# EAGLE board borrador_1 (EAGLE 9.5.2)
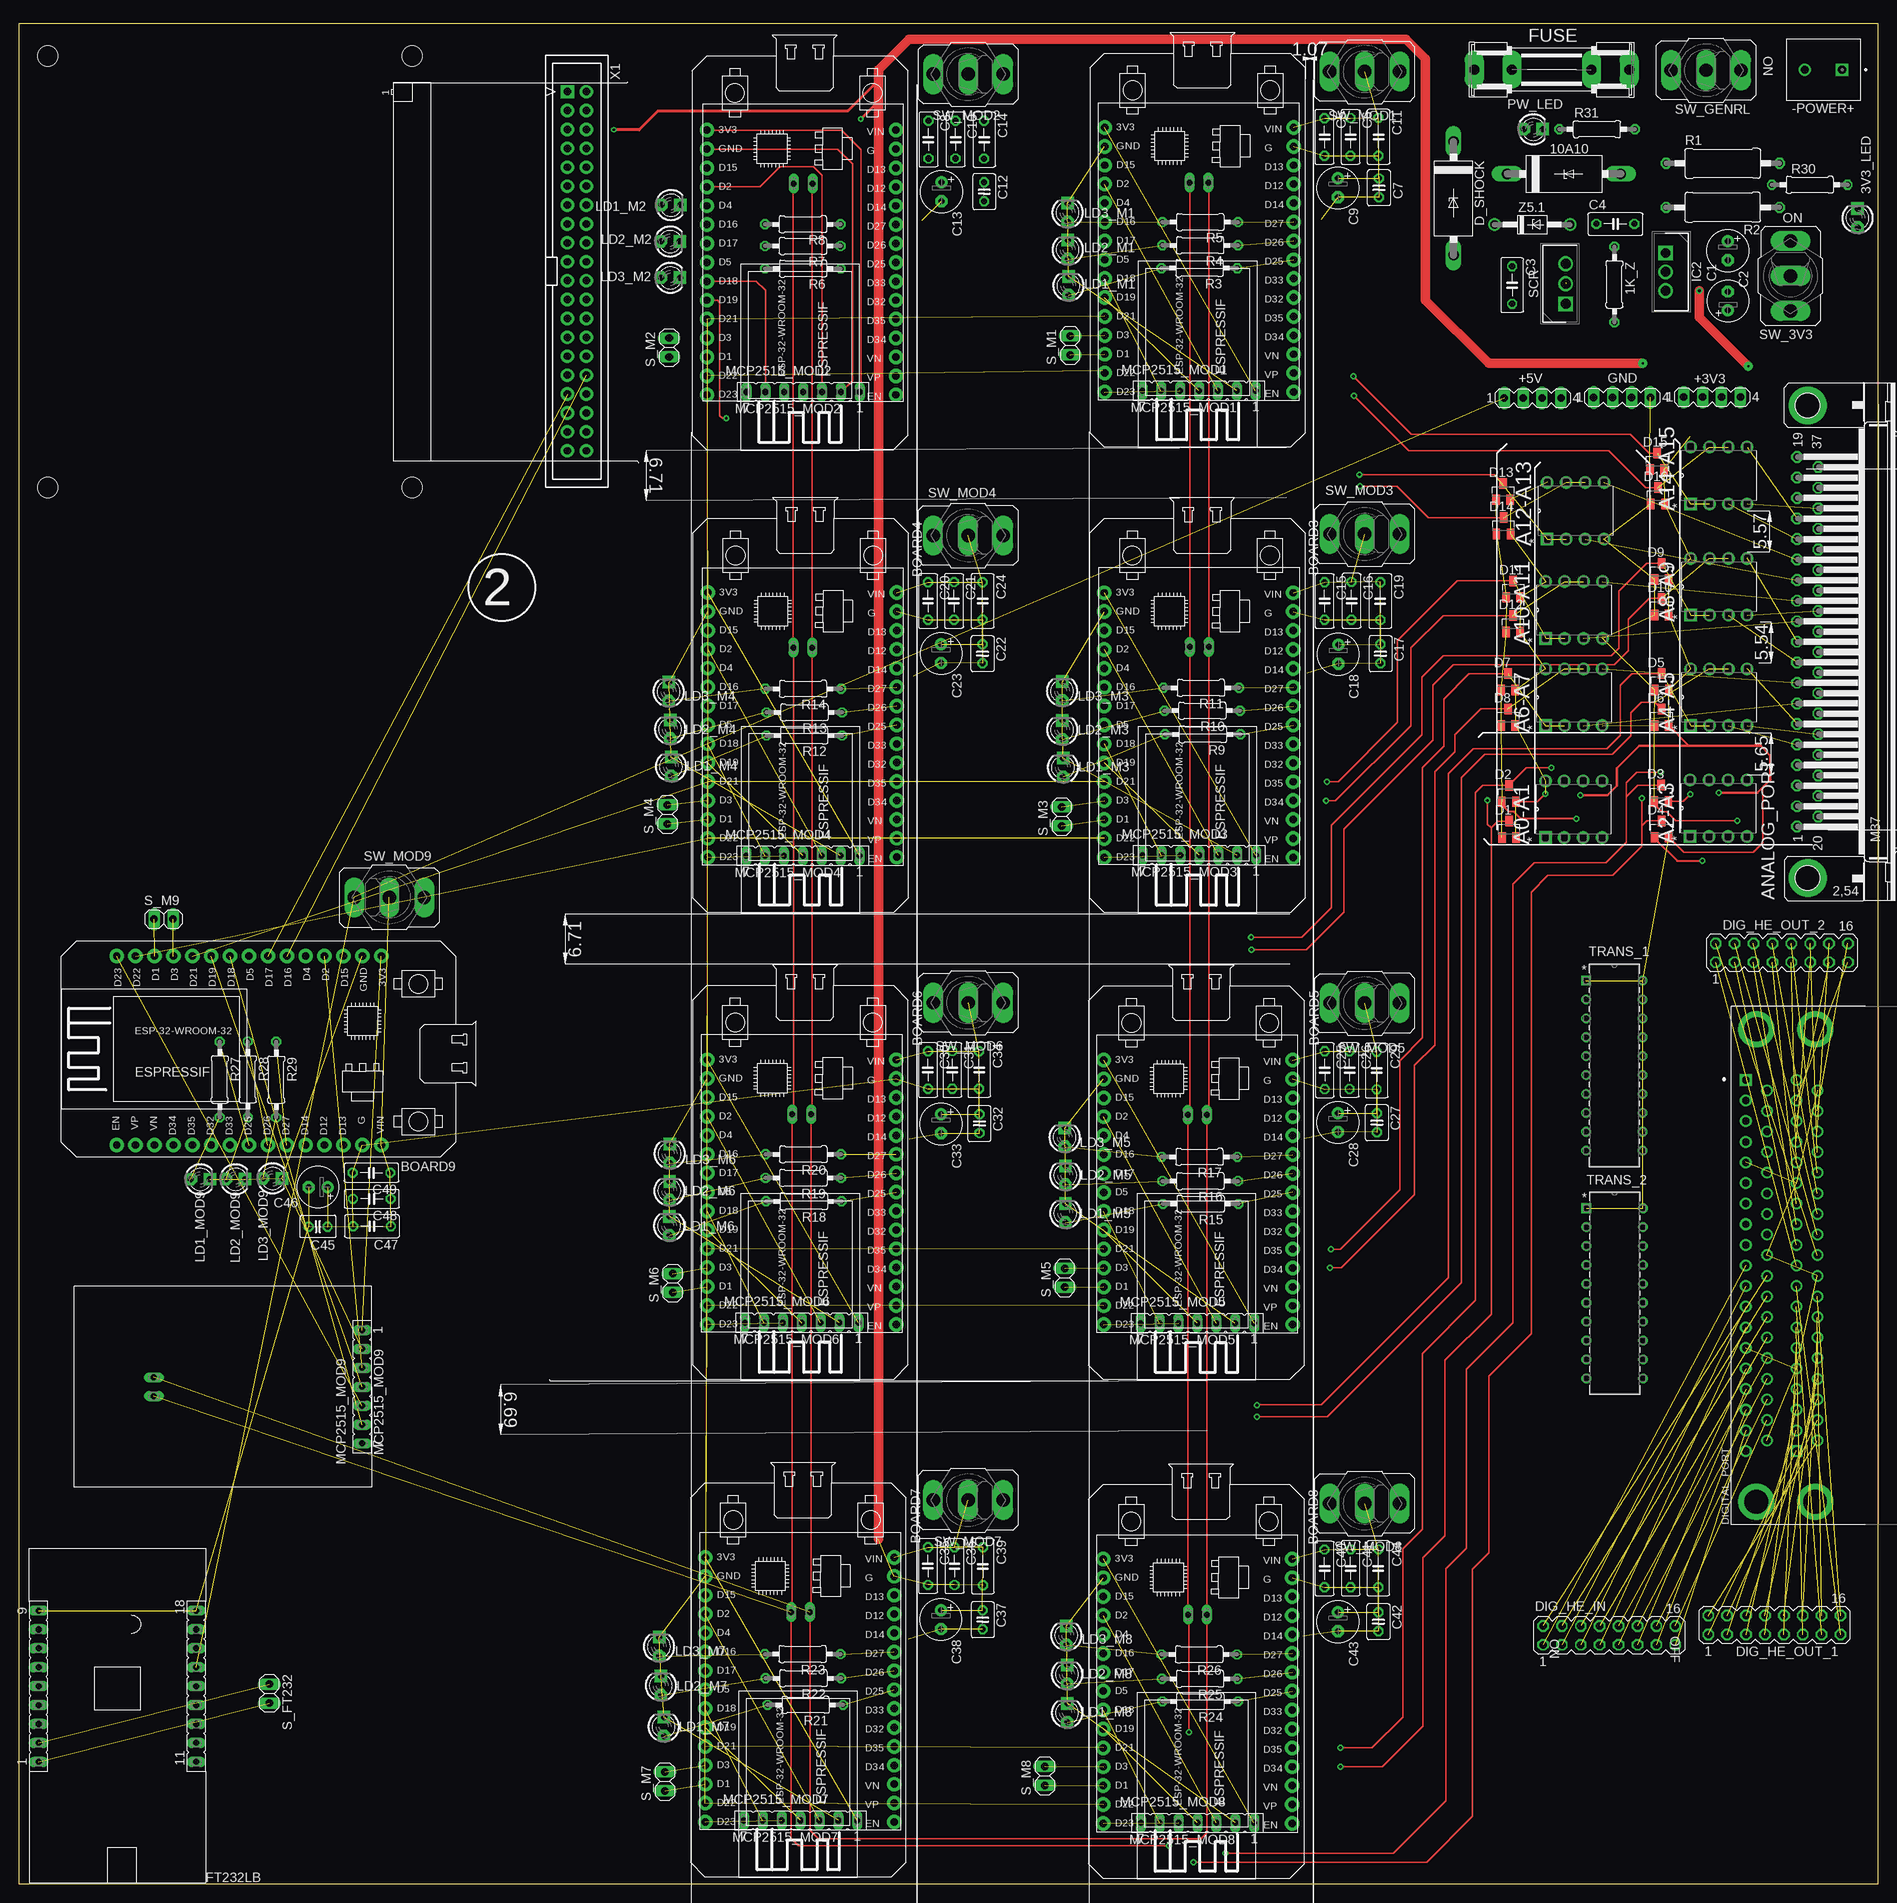
[diagram p9: board, top side]
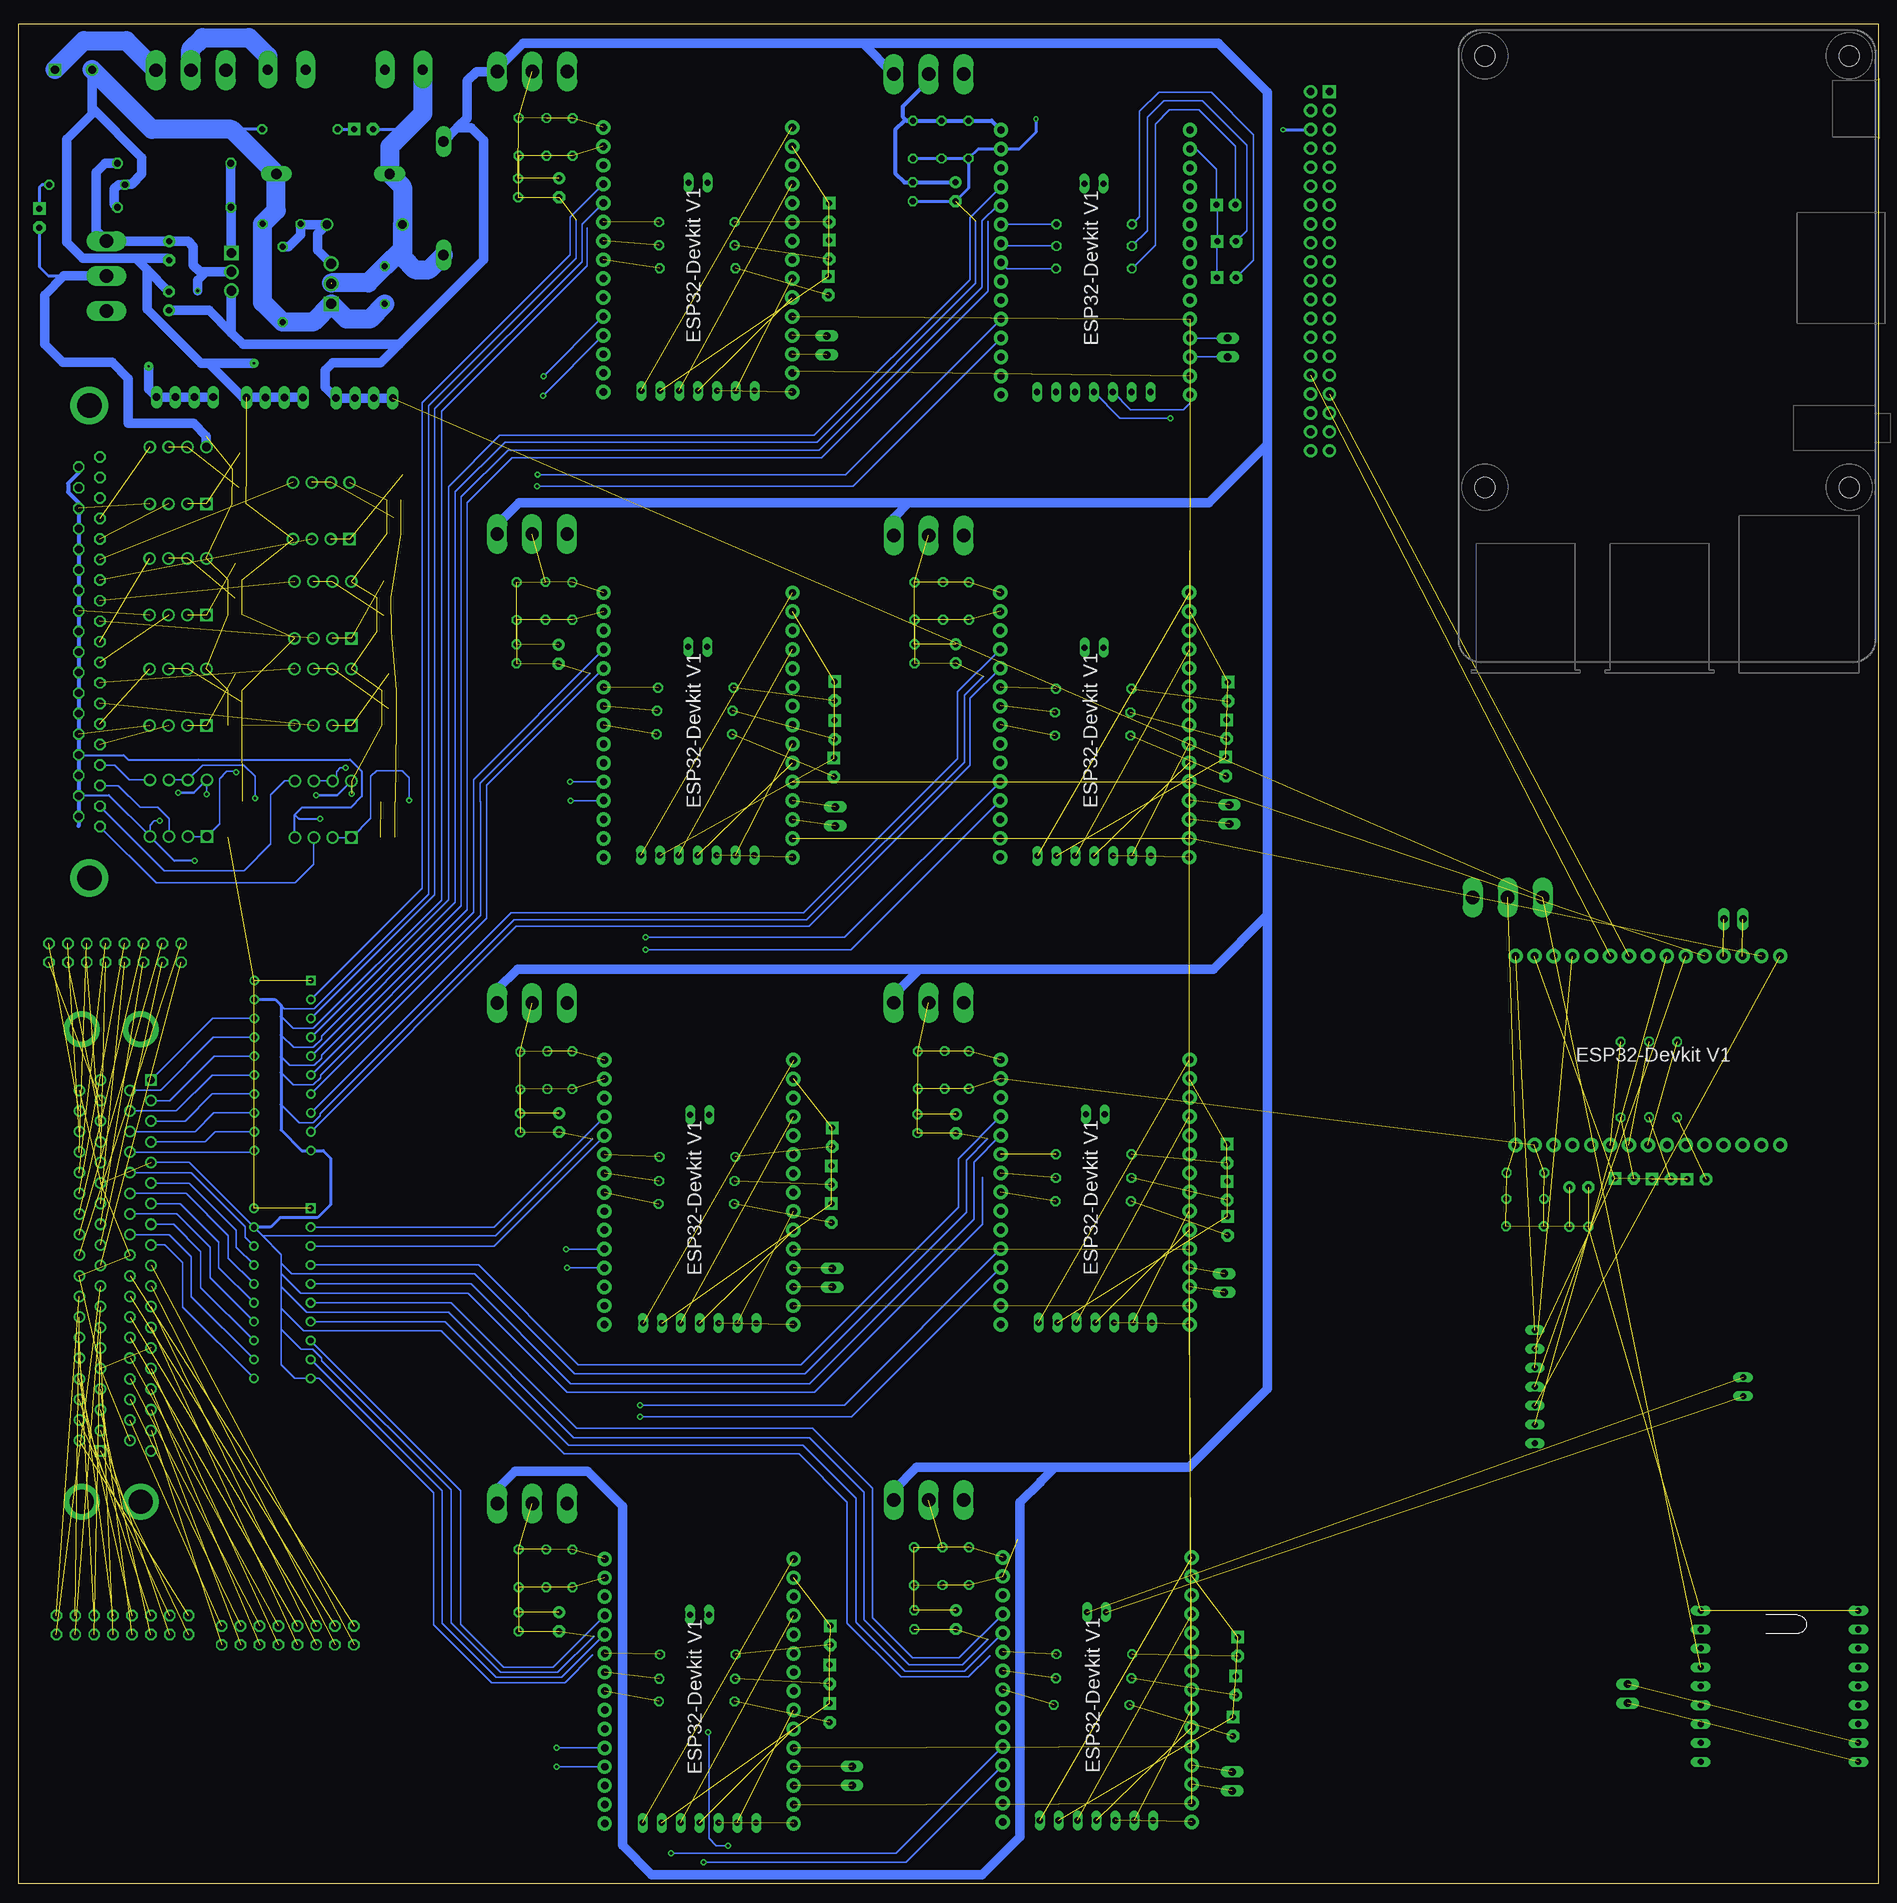
[diagram p10: board, bottom side, seen from below]

Size 250 x 250 mm. Coordinates in mm from the lower left corner, seen from the top.
Outline: 0,0 250,0 250,250 0,250 0,0
Copper layers (1*16): Top 0.035mm / dielectric 12mil / Bottom 0.035mm
Design rules "default *": minimum track width 0.2mm, minimum drill 0.3mm, track to track 0.4mm, track to pad 0.4mm, pad to pad 0.4mm, via to via 0.4mm, smd to smd 6mil, copper to edge 0.4mm, drill to drill 0.4mm, minimum pad ring 10mil, minimum via ring 8mil, stop-mask expansion 4mil, vias tented up to drill 0mil, thermal gap 10mil

## Footprints (pad centres in the part's own frame; a part is rotated, then mirrored left to right if it is on the bottom)
0207/10 = drill 0.813 octagon: 1 -5.08,0; 2 5.08,0
LED3MM = drill 0.813 pad 1.676 octagon: A -1.27,0 | drill 0.813 pad 1.676 square: K 1.27,0
CB429-15 = drill 1.397 long: A 7.62,0; C -7.62,0
MA04-1 = drill 1.016 long: 1 -3.81,0; 2 -1.27,0; 3 1.27,0; 4 3.81,0
CONN_282836-2 = drill 1.1 square: 1 -2.5,0 | drill 1.1: 2 2.5,0
DIP254P762X508-8 = drill 1.118 square: 1 -7.62,7.62 | drill 1.118: 2 -7.62,5.08; 3 -7.62,2.54; 4 -7.62,0; 5 0,0; 6 0,2.54; 7 0,5.08; 8 0,7.62
M37HP = drill 1.016 octagon: 1 -24.841,1.42; 2 -22.098,1.42; 3 -19.329,1.42; 4 -16.561,1.42; 5 -13.818,1.42; 6 -11.049,1.42; 7 -8.28,1.42; 8 -5.512,1.42; 9 -2.769,1.42; 10 0,1.42; 11 2.769,1.42; 12 5.512,1.42; 13 8.28,1.42; 14 11.049,1.42; 15 13.792,1.42; 16 16.561,1.42; 17 19.329,1.42; 18 22.073,1.42; 19 24.841,1.42; 20 -23.47,-1.42; 21 -20.701,-1.42; 22 -17.958,-1.42; 23 -15.189,-1.42; 24 -12.421,-1.42; 25 -9.652,-1.42; 26 -6.909,-1.42; 27 -4.14,-1.42; 28 -1.372,-1.42; 29 1.372,-1.42; 30 4.14,-1.42; 31 6.909,-1.42; 32 9.652,-1.42; 33 12.421,-1.42; 34 15.189,-1.42; 35 17.932,-1.42; 36 20.701,-1.42; 37 23.47,-1.42 | drill 3.302 pad 5.08: G1 -31.75,0; G2 31.75,0
ESP32-DEVKITV1 = drill 1 pad 1.93: 3V3 0,0; D1 30.48,0; D2 7.62,0; D3 27.94,0; D4 10.16,0; D5 17.78,0; D12 7.62,25.4; D13 5.08,25.4; D14 10.16,25.4; D15 5.08,0; D16 12.7,0; D17 15.24,0; D18 20.32,0; D19 22.86,0; D21 25.4,0; D22 33.02,0; D23 35.56,0; D25 17.78,25.4; D26 15.24,25.4; D27 12.7,25.4; D32 22.86,25.4; D33 20.32,25.4; D34 27.94,25.4; D35 25.4,25.4; EN 35.56,25.4; GND 2.54,25.4; GND@1 2.54,0; VIN 0,25.4; VN 30.48,25.4; VP 33.02,25.4
E2,5-6 = drill 0.813 pad 1.6: + -1.27,0 | drill 0.813 pad 1.6 octagon: - 1.27,0
C050-030X075 = drill 0.813 octagon: 1 -2.54,0; 2 2.54,0
C050-025X075 = drill 0.813 octagon: 1 -2.54,0; 2 2.54,0
C025-030X050 = drill 0.813 octagon: 1 -1.27,0; 2 1.27,0
SOT23 = smd 1 x 1.4: 1 -0.95,-1.1; 2 0.95,-1.1; 3 0,1.1
MA08-2 = drill 1.016 octagon: 1 -8.89,-1.27; 2 -8.89,1.27; 3 -6.35,-1.27; 4 -6.35,1.27; 5 -3.81,-1.27; 6 -3.81,1.27; 7 -1.27,-1.27; 8 -1.27,1.27; 9 1.27,-1.27; 10 1.27,1.27; 11 3.81,-1.27; 12 3.81,1.27; 13 6.35,-1.27; 14 6.35,1.27; 15 8.89,-1.27; 16 8.89,1.27
ASSMANN_WSW_COMPONENTS_ASUB-277-37TP25_0 = drill 3.2 pad 4.85: 1 -31.75,9.65; 2 31.75,9.65; 3 -31.75,1.75; 4 31.75,1.75 | drill 1 pad 1.55 square: F1 24.93,11.07; M1 -24.93,4.27 | drill 1 pad 1.55: F2 22.16,11.07; F3 19.39,11.07; F4 16.62,11.07; F5 13.85,11.07; F6 11.08,11.07; F7 8.31,11.07; F8 5.54,11.07; F9 2.77,11.07; F10 0,11.07; F11 -2.77,11.07; F12 -5.54,11.07; F13 -8.31,11.07; F14 -11.08,11.07; F15 -13.85,11.07; F16 -16.62,11.07; F17 -19.39,11.07; F18 -22.16,11.07; F19 -24.93,11.07; F20 23.545,8.23; F21 20.775,8.23; F22 18.005,8.23; F23 15.235,8.23; F24 12.465,8.23; F25 9.695,8.23; F26 6.925,8.23; F27 4.155,8.23; F28 1.385,8.23; F29 -1.385,8.23; F30 -4.155,8.23; F31 -6.925,8.23; F32 -9.695,8.23; F33 -12.465,8.23; F34 -15.235,8.23; F35 -18.005,8.23; F36 -20.775,8.23; F37 -23.545,8.23; M2 -22.16,4.27; M3 -19.39,4.27; M4 -16.62,4.27; M5 -13.85,4.27; M6 -11.08,4.27; M7 -8.31,4.27; M8 -5.54,4.27; M9 -2.77,4.27; M10 0,4.27; M11 2.77,4.27; M12 5.54,4.27; M13 8.31,4.27; M14 11.08,4.27; M15 13.85,4.27; M16 16.62,4.27; M17 19.39,4.27; M18 22.16,4.27; M19 24.93,4.27; M20 -23.545,1.43; M21 -20.775,1.43; M22 -18.005,1.43; M23 -15.235,1.43; M24 -12.465,1.43; M25 -9.695,1.43; M26 -6.925,1.43; M27 -4.155,1.43; M28 -1.385,1.43; M29 1.385,1.43; M30 4.155,1.43; M31 6.925,1.43; M32 9.695,1.43; M33 12.465,1.43; M34 15.235,1.43; M35 18.005,1.43; M36 20.775,1.43; M37 23.545,1.43
FT232BL = drill 0.813 long: 1 1.27,1.27; 2 1.27,3.81; 3 1.27,6.35; 4 1.27,8.89; 5 1.27,11.43; 6 1.27,13.97; 7 1.27,16.51; 8 1.27,19.05; 9 1.27,21.59; 10 22.47,1.27; 11 22.47,3.81; 12 22.47,6.35; 13 22.47,8.89; 14 22.47,11.43; 15 22.47,13.97; 16 22.47,16.51; 17 22.47,19.05; 18 22.47,21.59
SHK20L = drill 1.321 pad 2.54 long: 1A -10.414,0; 1B -5.334,0; 2A 10.414,0; 2B 5.334,0
TO255P460X1020X2008-3P = drill 1.32 pad 1.98 square: 1 0,0 | drill 1.32 pad 1.98: 2 2.55,0; 3 5.1,0
MCP2515 = drill 0.813 long: 1 1.27,-6.35; 2 1.27,-3.81; 3 1.27,-1.27; 4 1.27,1.27; 5 1.27,3.81; 6 1.27,6.35; 7 1.27,8.89; 8 29.27,0; 9 29.27,2.54
0411/15 = drill 0.914 octagon: 1 -7.62,0; 2 7.62,0
1X02 = drill 1.016 long: 1 -1.27,0; 2 1.27,0
TO270P460X1020X2008-3P = drill 1.32 pad 1.98 square: 1 0,0 | drill 1.32 pad 1.98: 2 2.7,0; 3 5.4,0
M9040P = drill 1.803 long: 1 0,4.699; 2 0,0; 3 0,-4.699
N20 = drill 0.787 pad 1.295 square: 1 0,0 | drill 0.787 pad 1.295: 2 0,-2.54; 3 0,-5.08; 4 0,-7.62; 5 0,-10.16; 6 0,-12.7; 7 0,-15.24; 8 0,-17.78; 9 0,-20.32; 10 0,-22.86; 11 7.62,-22.86; 12 7.62,-20.32; 13 7.62,-17.78; 14 7.62,-15.24; 15 7.62,-12.7; 16 7.62,-10.16; 17 7.62,-7.62; 18 7.62,-5.08; 19 7.62,-2.54; 20 7.62,0
RASPI_GPIO_B+_BOX = drill 1 pad 1.778 square: 1 -24.13,-1.27 | drill 1 pad 1.778: 2 -24.13,1.27; 3 -21.59,-1.27; 4 -21.59,1.27; 5 -19.05,-1.27; 6 -19.05,1.27; 7 -16.51,-1.27; 8 -16.51,1.27; 9 -13.97,-1.27; 10 -13.97,1.27; 11 -11.43,-1.27; 12 -11.43,1.27; 13 -8.89,-1.27; 14 -8.89,1.27; 15 -6.35,-1.27; 16 -6.35,1.27; 17 -3.81,-1.27; 18 -3.81,1.27; 19 -1.27,-1.27; 20 -1.27,1.27; 21 1.27,-1.27; 22 1.27,1.27; 23 3.81,-1.27; 24 3.81,1.27; 25 6.35,-1.27; 26 6.35,1.27; 27 8.89,-1.27; 28 8.89,1.27; 29 11.43,-1.27; 30 11.43,1.27; 31 13.97,-1.27; 32 13.97,1.27; 33 16.51,-1.27; 34 16.51,1.27; 35 19.05,-1.27; 36 19.05,1.27; 37 21.59,-1.27; 38 21.59,1.27; 39 24.13,-1.27; 40 24.13,1.27
RASPI_BOARD_B+_FULL = hole 2.75: 3.5,3.5; 3.5,52.5; 61.5,3.5; 61.5,52.5
DO41Z10 = drill 1.118: A 5.08,0; C -5.08,0

## Placement (x,y rotation side)
1K_Z  [0207/10]  214.52,214.94 270 top
3V3_LED  [LED3MM]  247.22,223.85 90 top
10A10  [CB429-15]  207.74,229.78 0 top
+3V3  [MA04-1]  227.65,199.78 0 top
+5V  [MA04-1]  203.52,199.65 0 top
-POWER+  282836-2  [CONN_282836-2]  242.62,243.8 180 top
A0-A1  OPA2350PA  [DIP254P762X508-8]  212.86,148.22 90 top
A2-A3  OPA2350PA  [DIP254P762X508-8]  232.32,148.36 90 top
A4-A5  OPA2350PA  [DIP254P762X508-8]  232.38,163.27 90 top
A6-A7  OPA2350PA  [DIP254P762X508-8]  212.89,163.26 90 top
A8-A9  OPA2350PA  [DIP254P762X508-8]  232.38,178.12 90 top
A10-A11  OPA2350PA  [DIP254P762X508-8]  212.91,175 90 top
A12-A13  OPA2350PA  [DIP254P762X508-8]  213.12,188.32 90 top
A14-A15  OPA2350PA  [DIP254P762X508-8]  232.37,193.07 90 top
ANALOG_PORT  [M37HP]  240.5,166.91 90 top
BOARD1  ESP32DEVKITV1  [ESP32-DEVKITV1]  146,236.03 270 top
BOARD2  ESP32DEVKITV1  [ESP32-DEVKITV1]  92.54,235.67 270 top
BOARD3  ESP32DEVKITV1  [ESP32-DEVKITV1]  145.96,173.5 270 top
BOARD4  ESP32DEVKITV1  [ESP32-DEVKITV1]  92.63,173.52 270 top
BOARD5  ESP32DEVKITV1  [ESP32-DEVKITV1]  145.85,110.7 270 top
BOARD6  ESP32DEVKITV1  [ESP32-DEVKITV1]  92.58,110.74 270 top
BOARD7  ESP32DEVKITV1  [ESP32-DEVKITV1]  92.3,43.86 270 top
BOARD8  ESP32DEVKITV1  [ESP32-DEVKITV1]  145.82,43.66 270 top
BOARD9  ESP32DEVKITV1  [ESP32-DEVKITV1]  48.75,124.68 180 top
C1  [E2,5-6]  229.79,212.71 90 top
C2  [E2,5-6]  229.77,219.47 270 top
C3  [C050-030X075]  200.77,214.85 270 top
C4  [C050-030X075]  214.65,223.06 0 top
C5  0.1uF  [C050-025X075]  175.54,234.75 270 top
C6  0.1uF  [C050-025X075]  179.05,234.76 270 top
C7  10uF  [C025-030X050]  182.86,227.91 270 top
C8  0.1uF  [C050-025X075]  122.3,234.4 270 top
C9  100uF  [E2,5-6]  177.35,227.91 270 top
C10  0.1uF  [C050-025X075]  125.95,234.4 270 top
C11  1uF  [C050-030X075]  182.8,234.77 270 top
C12  10uF  [C025-030X050]  129.8,227.39 270 top
C13  100uF  [E2,5-6]  124.06,227.39 270 top
C14  1uF  [C050-030X075]  129.79,234.39 270 top
C15  0.1uF  [C050-025X075]  175.56,172.39 270 top
C16  0.1uF  [C050-025X075]  179.18,172.41 270 top
C17  10uF  [C025-030X050]  183.08,165.31 270 top
C18  100uF  [E2,5-6]  177.39,165.24 270 top
C19  1uF  [C050-030X075]  183.05,172.38 270 top
C20  0.1uF  [C050-025X075]  122.25,172.39 270 top
C21  0.1uF  [C050-025X075]  125.74,172.4 270 top
C22  10uF  [C025-030X050]  129.58,165.31 270 top
C23  100uF  [E2,5-6]  124.02,165.33 270 top
C24  1uF  [C050-030X075]  129.58,172.39 270 top
C25  0.1uF  [C050-025X075]  175.57,109.34 270 top
C26  0.1uF  [C050-025X075]  178.92,109.35 270 top
C27  10uF  [C025-030X050]  182.58,102.28 270 top
C28  100uF  [E2,5-6]  177.35,102.3 270 top
C29  1uF  [C050-030X075]  182.56,109.29 270 top
C30  0.1uF  [C050-025X075]  122.24,109.36 270 top
C31  0.1uF  [C050-025X075]  125.51,109.37 270 top
C32  10uF  [C025-030X050]  129.15,102.16 270 top
C33  100uF  [E2,5-6]  124,102.12 270 top
C34  1uF  [C050-030X075]  129.12,109.36 270 top
C35  0.1uF  [C050-025X075]  122.24,42.7 270 top
C36  0.1uF  [C050-025X075]  125.81,42.69 270 top
C37  10uF  [C025-030X050]  129.6,35.48 270 top
C38  100uF  [E2,5-6]  123.97,35.5 270 top
C39  1uF  [C050-030X075]  129.62,42.66 270 top
C40  0.1uF  [C050-025X075]  175.55,42.37 270 top
C41  0.1uF  [C050-025X075]  179.06,42.39 270 top
C42  10uF  [C025-030X050]  182.8,35.22 270 top
C43  100uF  [E2,5-6]  177.36,35.21 270 top
C44  1uF  [C050-030X075]  182.78,42.39 270 top
C45  10uF  [C025-030X050]  40.25,88.31 180 top
C46  100uF  [E2,5-6]  40.25,93.63 180 top
C47  1uF  [C050-030X075]  47.51,88.36 180 top
C48  0.1uF  [C050-025X075]  47.48,92.03 180 top
C49  0.1uF  [C050-025X075]  47.43,95.54 180 top
D1  BAT54S  [SOT23]  200.35,141.72 0 top
D2  BAT54S  [SOT23]  200.34,146.51 0 top
D3  BAT54S  [SOT23]  220.82,146.56 0 top
D4  BAT54S  [SOT23]  220.86,141.74 0 top
D5  BAT54S  [SOT23]  220.88,161.52 0 top
D6  BAT54S  [SOT23]  220.86,156.76 0 top
D7  BAT54S  [SOT23]  200.23,161.52 0 top
D8  BAT54S  [SOT23]  200.23,156.78 0 top
D9  BAT54S  [SOT23]  220.87,176.36 0 top
D10  BAT54S  [SOT23]  220.87,171.63 0 top
D11  BAT54S  [SOT23]  200.92,173.99 0 top
D12  BAT54S  [SOT23]  200.89,169.34 0 top
D13  BAT54S  [SOT23]  199.56,187.1 0 top
D14  BAT54S  [SOT23]  199.6,182.51 0 top
D15  BAT54S  [SOT23]  220.26,191.17 0 top
D16  BAT54S  [SOT23]  220.36,186.54 0 top
D_SHOCK  [CB429-15]  192.88,226.5 270 top
DIG_HE_IN  [MA08-2]  213.81,33.38 0 top
DIG_HE_OUT_1  [MA08-2]  236.03,34.76 0 top
DIG_HE_OUT_2  [MA08-2]  237.03,125.11 0 top
DIGITAL_PORT  ASSMANN_WSW_COMPONENTS_ASUB-277-37TP25ASSMANN_WSW_COMPONENTS_ASUB-277-37TP25_0_0  [ASSMANN_WSW_COMPONENTS_ASUB-277-37TP25_0]  243.25,83.09 90 top
FT232LB  [FT232BL]  1.41,15.12 0 top
FUSE  FUSESHK20L  [SHK20L]  206.09,243.8 180 top
GND  [MA04-1]  215.56,199.74 0 top
IC2  LM317T  [TO255P460X1020X2008-3P]  221.39,219.17 270 top
LD1_M1  [LED3MM]  141.15,214.76 90 top
LD1_M2  [LED3MM]  87.7,225.62 0 top
LD1_M3  [LED3MM]  140.41,150.02 90 top
LD1_M4  [LED3MM]  87.72,150.14 90 top
LD1_M5  [LED3MM]  140.73,90.12 90 top
LD1_M6  [LED3MM]  87.48,88.41 90 top
LD1_M7  [LED3MM]  86.74,21.12 90 top
LD1_M8  [LED3MM]  140.97,22.97 90 top
LD1_MOD9  [LED3MM]  24.43,94.68 0 top
LD2_M1  [LED3MM]  141.05,219.61 90 top
LD2_M2  [LED3MM]  87.6,220.72 0 top
LD2_M3  [LED3MM]  140.31,155.08 90 top
LD2_M4  [LED3MM]  87.6,155.15 90 top
LD2_M5  [LED3MM]  140.73,95.22 90 top
LD2_M6  [LED3MM]  87.51,93.13 90 top
LD2_M7  [LED3MM]  86.36,26.62 90 top
LD2_M8  [LED3MM]  140.96,28.14 90 top
LD2_MOD9  [LED3MM]  29.16,94.69 0 top
LD3_M1  [LED3MM]  141.03,224.6 90 top
LD3_M2  [LED3MM]  87.62,215.84 0 top
LD3_M3  [LED3MM]  140.3,160.28 90 top
LD3_M4  [LED3MM]  87.41,160.21 90 top
LD3_M5  [LED3MM]  140.64,100.32 90 top
LD3_M6  [LED3MM]  87.54,98.12 90 top
LD3_M7  [LED3MM]  86.11,31.87 90 top
LD3_M8  [LED3MM]  140.86,33.38 90 top
LD3_MOD9  [LED3MM]  34.14,94.81 0 top
MCP2515_MOD1  [MCP2515]  159.94,199.36 90 top
MCP2515_MOD2  [MCP2515]  106.73,199.21 90 top
MCP2515_MOD3  [MCP2515]  159.99,136.95 90 top
MCP2515_MOD4  [MCP2515]  106.69,136.86 90 top
MCP2515_MOD5  [MCP2515]  159.72,74.08 90 top
MCP2515_MOD6  [MCP2515]  106.54,74.14 90 top
MCP2515_MOD7  [MCP2515]  106.38,7.23 90 top
MCP2515_MOD8  [MCP2515]  159.74,6.9 90 top
MCP2515_MOD9  [MCP2515]  47.45,68.06 180 top
PW_LED  [LED3MM]  203.62,235.8 0 top
R1  [0411/15]  229.09,231.22 0 top
R2  [0411/15]  229.08,225.29 180 top
R3  [0207/10]  158.73,217.13 180 top
R4  [0207/10]  158.82,220.19 180 top
R5  [0207/10]  158.84,223.32 180 top
R6  [0207/10]  105.44,217.07 180 top
R7  [0207/10]  105.42,220.1 180 top
R8  [0207/10]  105.42,223.02 180 top
R9  [0207/10]  159.17,154.47 180 top
R10  [0207/10]  159.11,157.65 180 top
R11  [0207/10]  158.95,160.71 180 top
R12  [0207/10]  105.6,154.31 180 top
R13  [0207/10]  105.61,157.41 180 top
R14  [0207/10]  105.46,160.58 180 top
R15  [0207/10]  158.89,91.36 180 top
R16  [0207/10]  158.84,94.44 180 top
R17  [0207/10]  158.74,97.68 180 top
R18  [0207/10]  105.54,91.7 180 top
R19  [0207/10]  105.47,94.85 180 top
R20  [0207/10]  105.49,98.03 180 top
R21  [0207/10]  105.77,24.03 180 top
R22  [0207/10]  105.49,27.61 180 top
R23  [0207/10]  105.39,30.87 180 top
R24  [0207/10]  158.85,24.5 180 top
R25  [0207/10]  158.79,27.53 180 top
R26  [0207/10]  158.69,30.81 180 top
R27  [0207/10]  27.05,108.09 270 top
R28  [0207/10]  30.82,108.11 270 top
R29  [0207/10]  34.64,108.06 270 top
R30  [0207/10]  240.78,228.33 180 top
R31  [0207/10]  212.17,235.79 0 top
S_FT232  [1X02]  33.7,25.56 270 top
S_M1  [1X02]  141.36,206.75 90 top
S_M2  [1X02]  87.44,206.46 90 top
S_M3  [1X02]  140.22,143.44 90 top
S_M4  [1X02]  87.23,143.72 90 top
S_M5  [1X02]  140.63,81.44 90 top
S_M6  [1X02]  87.92,80.74 90 top
S_M7  [1X02]  86.88,13.75 90 top
S_M8  [1X02]  137.96,14.5 90 top
S_M9  [1X02]  19.48,129.63 0 top
SCR  TYN608RG  [TO270P460X1020X2008-3P]  207.97,212.32 90 top
SW_3V3  [M9040P]  238.19,216.07 180 top
SW_GENRL  [M9040P]  226.84,243.72 90 top
SW_MOD1  [M9040P]  180.95,243.53 90 top
SW_MOD2  [M9040P]  127.66,243.19 90 top
SW_MOD3  [M9040P]  180.97,181.39 90 top
SW_MOD4  [M9040P]  127.65,181.21 90 top
SW_MOD5  [M9040P]  180.97,118.34 90 top
SW_MOD6  [M9040P]  127.66,118.4 90 top
SW_MOD7  [M9040P]  127.65,51.55 90 top
SW_MOD8  [M9040P]  180.96,51.1 90 top
SW_MOD9  [M9040P]  49.82,132.56 270 top
TRANS_1  SN74LVC245AN  [N20]  210.7,121.38 0 top
TRANS_2  SN74LVC245AN  [N20]  210.74,90.78 0 top
X1  RASPI_GPIO_B+_BOX  [RASPI_GPIO_B+_BOX]  75.05,216.71 270 top
X2  RASPI_BOARD_B+#_F  [RASPI_BOARD_B+_FULL]  0.41,249.15 270 top
Z5.1  [DO41Z10]  203.48,222.97 0 top

## Tracks (layer width: path | path; a pad name or v marks a point on that pad's centre or on a via)
3V  (via drill 0.3 pad 1.2, 0.4)
  Top 1.27: v225.93,214.09 225.93,210.51 v232.5,203.94
  Bottom 1.27: R1.2 238.37,231.22 239.58,230.01 239.58,222.16 SW_3V3.3 238.16,220.74 C2.+ 227.23,220.74 226.5,220.01 226.5,217.54 225.58,216.62 224.78,216.62 | +3V3.1 +3V3.2 +3V3.3 +3V3.4 232.5,200.83 v232.5,203.94 | IC2.2 224.78,216.62 | 224.78,216.62 225.93,215.47 v225.93,214.09
5V  (2 unrouted)
  Bottom 0.406: 129.58,247.33 129.57,247.32
  Bottom 1.27: 136.49,247.32 SW_MOD2.3 | 136.49,247.32 182.18,247.32 185.65,243.85 SW_MOD1.3 188.46,243.53 189.7,242.29 189.7,237.3 191.03,235.97 | 136.49,247.32 129.57,247.32 | 129.58,247.33 88.71,247.33 82.12,240.74 82.12,193.44 | SW_MOD4.3 132.35,183.59 130.34,185.6 | 131.04,185.62 131.06,185.6 | 131.06,185.6 182.7,185.6 185.67,182.63 SW_MOD3.3 | 130.34,185.6 89.96,185.6 82.12,193.44 | 130.34,185.6 131.06,185.6 | 82.12,193.44 82.12,130.25 82.1,130.23 | SW_MOD5.3 185.67,120.21 182.95,122.93 128.86,122.93 | 82.1,130.23 89.4,122.93 128.86,122.93 | 128.86,122.93 132.36,119.43 SW_MOD6.3 | 82.1,130.23 82.1,66.52 92.65,55.97 110.7,55.97 | SW_MOD7.3 132.35,52.91 129.29,55.97 110.7,55.97 | 110.7,55.97 112.64,54.03 112.64,53.99 115.38,51.25 115.38,6.34 120.48,1.24 164.89,1.24 168.83,5.18 168.83,50.7 173.54,55.41 183.26,55.41 185.66,53.01 SW_MOD8.3 | D_SHOCK.C 191.03,235.97 | 221.39,208.47 IC2.3 | 198.85,206.89 219.81,206.89 221.39,208.47 | C1.+ 224.36,211.44 221.39,208.47 | 191.03,235.97 189.18,235.97 187.52,234.31 187.52,218.22 198.85,206.89 | 198.85,206.89 201.36,204.38 207.8,204.38 208.8,203.38 208.8,201.12 +5V.4 +5V.3 +5V.2 +5V.1
5V_MOD1  (6 unrouted)
5V_MOD2
  Bottom 0.508: SW_MOD2.2 127.66,242.34 131.16,238.84 131.16,237.48 130.61,236.93 C14.1 | C14.1 C10.1 C8.1 119.21,236.94 BOARD2.VIN | C14.1 130.93,236.93 132.16,235.7 132.16,229.9 130.92,228.66 C12.1 C13.+
5V_MOD3  (6 unrouted)
5V_MOD4  (6 unrouted)
5V_MOD5  (6 unrouted)
5V_MOD6  (6 unrouted)
5V_MOD7  (6 unrouted)
5V_MOD8  (6 unrouted)
5V_MOD9  (6 unrouted)
CAN_H  (via drill 0.4)  (1 unrouted)
  Top 0.2: MCP2515_MOD2.9 104.14,228.43 MCP2515_MOD4.9 104.15,103.56 MCP2515_MOD6.9 104,36.66 MCP2515_MOD7.9 103.84,6.14 104.86,5.12 v154.65,5.12 | v157.33,20.39 157.33,36.04 MCP2515_MOD8.9 157.18,36.19 MCP2515_MOD5.9 157.45,103.62 MCP2515_MOD3.9 157.45,228.58 MCP2515_MOD1.9
  Bottom 0.2: v154.65,5.12 156.22,5.12 157.19,6.09 157.19,20.25 v157.33,20.39
CAN_L  (1 unrouted)
  Top 0.2: MCP2515_MOD2.8 106.68,228.43 MCP2515_MOD4.8 106.69,103.56 MCP2515_MOD6.8 106.54,36.66 MCP2515_MOD7.8 106.38,7.18 107.5,6.06 158.97,6.06 159.74,6.83 MCP2515_MOD8.8 159.72,36.19 MCP2515_MOD5.8 159.99,103.62 MCP2515_MOD3.8 159.99,228.58 MCP2515_MOD1.8
GND_MOD1  (4 unrouted)
GND_MOD2
  Top 0.2: MCP2515_MOD2.2 112.08,202.02 112.08,231.13 110.08,233.13 BOARD2.GND@1
  Bottom 0.2: BOARD2.GND@1 91.67,233.13 88.97,230.43 LD1_M2.K 88.87,225.52 LD2_M2.K 88.89,220.7 LD3_M2.K
GND_MOD3  (4 unrouted)
GND_MOD4  (4 unrouted)
GND_MOD5  (4 unrouted)
GND_MOD6  (4 unrouted)
GND_MOD7  (4 unrouted)
GND_MOD8  (4 unrouted)
GND_MOD9  (4 unrouted)
L_3V3  (via drill 0.4)  (23 unrouted)
  Top 0.2: D3.2 223.77,145.46 v224.7,146.39 | D4.2 223.85,138.6 233.2,138.6 234.5,139.9 234.5,147.37 234.6,147.47 | v205.23,146.51 204.13,145.41 D2.2
  Top 0.305: D6.2 224.52,152.95 | 224.52,152.95 234.17,152.95 235.5,151.62 235.5,148.37 234.6,147.47 233.74,146.61 v228.55,146.61 | 224.52,152.95 217.89,152.95 214.84,149.9 214.84,147.58 213.56,146.3 v209.97,146.3
  Bottom 0.2: A2-A3.8 v224.7,146.39 | A0-A1.8 v205.23,146.51
  Bottom 0.305: v228.55,146.61 226.45,146.61 A2-A3.8 | v209.97,146.3 207.16,146.3 A0-A1.8
  Bottom 0.406: 3V3_LED.A 247.22,217.3 245.99,216.07 243.9,216.07
  Bottom 1.27: SW_3V3.2 243.9,216.07 246.49,213.48 246.49,206.88 244.08,204.47 237.44,204.47 235.24,202.27 235.24,196.25 226.48,196.25 224.75,194.52 A14-A15.8
L_AO_0  (via drill 0.4)
  Top 0.2: D1.3 198.86,142.82 197.95,141.91 | 197.95,141.91 197.95,76.54 191.76,70.35 191.76,46.8 188.78,43.82 188.78,21.18 183.32,15.72 v177.66,15.72 | v197.47,145.58 197.47,142.39 197.95,141.91
  Bottom 0.2: v177.66,15.72 BOARD8.D34 | A0-A1.2 A0-A1.1 202.67,143.17 202.67,148.82 201.89,149.6 198.46,149.6 197.47,148.61 v197.47,145.58
L_AO_0_P
  Bottom 0.2: A0-A1.3 210.32,136.99 212.75,134.56 212.8,134.51 212.81,134.5 231.52,134.5 ANALOG_PORT.1
L_AO_1  (via drill 0.4)
  Top 0.2: v177.69,18.26 181.92,18.26 186.06,22.4 186.06,45.01 188.68,47.63 188.68,71.22 195.85,78.39 195.85,146.63 196.83,147.61 D2.3 202.68,149.95 v206.04,149.95
  Bottom 0.2: v177.69,18.26 BOARD8.D35 | A0-A1.6 A0-A1.7 207.27,148.73 207.27,149.45 206.77,149.95 v206.04,149.95
L_AO_1_P
  Bottom 0.2: A0-A1.5 214.23,148.22 216.09,146.36 216.09,139.74 219.67,136.16 230.43,136.16 ANALOG_PORT.2
L_AO_2  (via drill 0.4)
  Top 0.2: D3.3 217.65,147.66 216.1,146.11 | 216.1,146.11 216.1,139.95 213.34,137.19 203.74,137.19 200.87,134.32 200.87,75.41 194.63,69.17 194.63,45.08 191.89,42.34 191.89,11.14 184.83,4.08 v162.26,4.08 | v220.77,149.4 217.51,149.4 216.1,147.99 216.1,146.11
  Bottom 0.2: v162.26,4.08 132.08,4.08 BOARD7.D35 | v220.77,149.4 220.77,149.49 222,149.49 222.97,148.52 222.97,142.47 A2-A3.1 A2-A3.2
L_AO_2_P
  Bottom 0.2: A2-A3.3 229.78,143.14 231.31,144.66 233.68,144.66 236.59,147.58 ANALOG_PORT.3
L_AO_3  (via drill 0.4)
  Top 0.2: D4.3 218.9,142.84 218.23,142.17 | 218.23,142.17 218.23,139.42 214.32,135.51 205.6,135.51 203.36,133.27 203.36,73.92 197.66,68.22 197.66,44.48 195.45,42.27 195.45,9.04 189.31,2.9 v157.94,2.9 | v157.94,2.9 157.91,2.9 | v157.94,2.9 | v218.23,145.86 218.23,142.17
  Bottom 0.2: v157.94,2.9 130.72,2.9 BOARD7.D34 | v218.23,145.86 218.23,148.82 219.73,150.32 225.28,150.32 A2-A3.7 A2-A3.6
L_AO_3_P
  Bottom 0.2: ANALOG_PORT.4 237.11,150.35 235.12,148.36 A2-A3.5
L_AO_4  (via drill 0.4)  (2 unrouted)
  Top 0.2: D5.3 216.85,162.62 215.3,161.07 215.3,154.32 213.52,152.54 195.58,152.54 192.21,149.17 192.21,81.46 175.1,64.35 166.49,64.35 v166.46,64.32
  Bottom 0.2: v166.46,64.32 139,64.32 BOARD6.D35
L_AO_4_P  (1 unrouted)
L_AO_5  (via drill 0.4)  (2 unrouted)
  Top 0.2: D6.3 219.96,158.76 218.11,158.76 216.73,157.38 216.73,154.28 214.24,151.79 197.08,151.79 193.96,148.67 193.96,80.75 175.97,62.76 v166.48,62.76
  Bottom 0.2: v166.48,62.76 138.02,62.76 BOARD6.D34
L_AO_5_P  (1 unrouted)
L_AO_6  (via drill 0.4)  (2 unrouted)
  Top 0.2: D7.3 194.97,162.62 191.57,159.22 191.57,152.84 188.71,149.98 188.71,113.67 185.67,110.63 185.67,93.27 177.7,85.3 v176.42,85.3
  Bottom 0.2: v176.42,85.3 BOARD5.D35
L_AO_6_P  (1 unrouted)
L_AO_7  (via drill 0.4)  (2 unrouted)
  Top 0.2: D8.3 196.54,157.88 193.08,154.42 193.08,152.11 190.41,149.44 190.41,112.72 187.66,109.97 187.66,92.62 177.83,82.79 v176.25,82.79
  Bottom 0.2: v176.25,82.79 171.28,82.79 BOARD5.D34
L_AO_7_P  (1 unrouted)
L_AO_8  (via drill 0.4)  (2 unrouted)
  Top 0.2: D9.3 218.9,177.46 215.12,173.68 215.12,166.05 214.1,165.03 191.52,165.03 188.62,162.13 188.62,154.4 176.5,142.28 176.5,131.19 172.49,127.18 v165.69,127.18
  Bottom 0.2: v165.69,127.18 138.97,127.18 BOARD4.D35
L_AO_8_P  (1 unrouted)
L_AO_9  (via drill 0.4)  (2 unrouted)
  Top 0.2: D10.3 219.2,172.73 216.41,169.94 216.41,165.69 214.52,163.8 192.88,163.8 190.15,161.07 190.15,153.66 178.19,141.7 178.19,130.53 173.15,125.49 v165.73,125.49
  Bottom 0.2: v165.73,125.49 138.12,125.49 BOARD4.D34
L_AO_9_P  (1 unrouted)
L_AO_10  (via drill 0.4)  (2 unrouted)
  Top 0.2: D11.3 193.39,175.09 185.35,167.05 185.35,156.08 177.39,148.12 v175.87,148.12
  Bottom 0.2: v175.87,148.12 171.38,148.12 BOARD3.D35
L_AO_10_P  (1 unrouted)
L_AO_11  (via drill 0.4)  (2 unrouted)
  Top 0.2: D12.3 191.5,170.44 187.15,166.09 187.15,155.64 177.04,145.53 v175.77,145.53
  Bottom 0.2: v175.77,145.53 171.39,145.53 BOARD3.D34
L_AO_11_P  (1 unrouted)
L_AO_12  (via drill 0.4)  (2 unrouted)
  Top 0.2: D13.3 198.37,189.39 v180.24,189.39
  Bottom 0.2: BOARD2.D35 138.82,189.39 v180.24,189.39
L_AO_12_P  (1 unrouted)
L_AO_13  (via drill 0.4)  (2 unrouted)
  Top 0.2: D14.3 189.5,183.61 185.29,187.82 v180.32,187.82
  Bottom 0.2: v180.32,187.82 137.85,187.82 BOARD2.D34
L_AO_13_P  (1 unrouted)
L_AO_14  (via drill 0.4)  (2 unrouted)
  Top 0.2: D15.3 219.19,192.27 216.67,194.79 187.24,194.79 v179.43,202.6
  Bottom 0.2: v179.43,202.6 BOARD1.D35
L_AO_14_P  (1 unrouted)
L_AO_15  (via drill 0.4)  (2 unrouted)
  Top 0.2: D16.3 218.76,187.64 213.8,192.6 213.8,192.61 186.88,192.61 v179.49,200
  Bottom 0.2: v179.49,200 BOARD1.D34
L_AO_15_P  (1 unrouted)
L_DI_0
  Bottom 0.2: TRANS_1.2 195.78,133.76 195.78,199.01 175.85,218.94 175.85,223.96 BOARD1.D12
L_DI_0_P
  Bottom 0.2: DIGITAL_PORT.F1 223.9,116.3 TRANS_1.18
L_DI_1
  Bottom 0.2: TRANS_1.3 194.06,132.94 194.06,198.22 174.28,218 174.28,222.99 BOARD1.D14
L_DI_1_P
  Bottom 0.2: DIGITAL_PORT.F20 234.99,106.67 230.93,106.67 223.83,113.76 TRANS_1.17
L_DI_2
  Bottom 0.2: TRANS_1.4 192.21,132.25 192.21,187.77 185.32,194.66 143.05,194.66 122.12,215.59 122.12,223.87 BOARD2.D12
L_DI_2_P
  Bottom 0.2: DIGITAL_PORT.F2 229.69,105.25 223.72,111.22 TRANS_1.16
L_DI_3
  Bottom 0.2: TRANS_1.5 190.49,131.43 190.49,186.4 184.22,192.67 142.37,192.67 120.47,214.57 120.47,223.48 118.44,225.51 BOARD2.D14
L_DI_3_P
  Bottom 0.2: DIGITAL_PORT.F21 228.81,103.86 223.99,108.68 TRANS_1.15
L_DI_4
  Bottom 0.2: TRANS_1.6 188.84,130.54 188.84,148.4 BOARD3.D12
L_DI_4_P
  Bottom 0.2: DIGITAL_PORT.F3 227.63,102.48 223.97,106.14 TRANS_1.14
L_DI_5
  Bottom 0.2: TRANS_1.7 187.1,129.74 187.1,147.6 BOARD3.D14
L_DI_5_P
  Bottom 0.2: DIGITAL_PORT.F22 226.25,101.09 223.75,103.6 TRANS_1.13
L_DI_6
  Bottom 0.2: TRANS_1.8 183.81,130.49 144.46,130.49 123.76,151.19 123.76,160.17 BOARD4.D12
L_DI_6_P
  Bottom 0.2: DIGITAL_PORT.F4 224.93,99.71 223.58,101.06 TRANS_1.12
L_DI_7
  Bottom 0.2: TRANS_1.9 183.11,128.65 143.73,128.65 122.08,150.3 122.08,159.31 BOARD4.D14
L_DI_7_P
  Bottom 0.2: DIGITAL_PORT.F23 218.51,98.33 TRANS_1.11
L_DI_8
  Bottom 0.2: TRANS_2.2 186.09,88.24 BOARD5.D12
L_DI_8_P
  Bottom 0.2: DIGITAL_PORT.F24 226.76,95.56 219.52,88.31 219.52,86.86 TRANS_2.18
L_DI_9
  Bottom 0.2: TRANS_2.3 186.09,85.7 BOARD5.D14
L_DI_9_P
  Bottom 0.2: DIGITAL_PORT.F6 227.07,94.17 220.74,87.84 220.74,85.54 TRANS_2.17
L_DI_10
  Bottom 0.2: TRANS_2.4 188.19,83.16 174.79,69.76 144.82,69.76 123.65,90.93 123.65,97.45 BOARD6.D12
L_DI_10_P
  Bottom 0.2: DIGITAL_PORT.F25 229.94,92.78 229.93,92.79 227.49,92.79 221.81,87.11 221.81,84.07 TRANS_2.16
L_DI_11
  Bottom 0.2: TRANS_2.5 189.17,80.62 175.77,67.22 143.68,67.22 121.59,89.31 121.59,96.97 BOARD6.D14
L_DI_11_P
  Bottom 0.2: DIGITAL_PORT.F7 228.28,91.4 223.07,86.19 223.07,82.79 TRANS_2.15
L_DI_012
  Bottom 0.2: TRANS_2.6 191.88,78.08 175,61.2 143.27,61.2 135.22,53.15 135.22,35.74 129.85,30.37 123.57,30.37 BOARD7.D12
L_DI_12_P
  Bottom 0.2: DIGITAL_PORT.F26 231.81,90.02 231.8,90.01 228.73,90.01 224.27,85.55 224.27,81.45 TRANS_2.14
L_DI_13
  Bottom 0.2: TRANS_2.7 192.69,75.54 176.07,58.92 144.53,58.92 137.45,51.84 137.45,35.16 130.87,28.58 122.82,28.58 BOARD7.D14
L_DI_13_P
  Bottom 0.2: TRANS_2.13 225.49,80.13 225.49,84.95 229.17,88.63 DIGITAL_PORT.F8
L_DI_014
  Bottom 0.2: TRANS_2.8 190.58,52.84 190.58,34.89 184.81,29.12 178.14,29.12 BOARD8.D12
L_DI_14_P
  Bottom 0.2: DIGITAL_PORT.F27 230.72,87.25 230.71,87.24 229.77,87.24 226.79,84.26 226.79,78.89 TRANS_2.12
L_DI_015
  Bottom 0.2: BOARD8.D14 176.99,27.73 185.81,27.73 193.07,34.99 193.07,52.79 TRANS_2.9
L_DI_15_P
  Bottom 0.2: TRANS_2.11 227.92,77.48 227.92,83.44 230.34,85.86 DIGITAL_PORT.F9
L_DI_16_P  (1 unrouted)
L_DI_17_P  (1 unrouted)
L_DI_18_P  (1 unrouted)
L_DI_19_P  (1 unrouted)
L_DI_20_P  (1 unrouted)
L_DI_21_P  (1 unrouted)
L_DI_22_P  (1 unrouted)
L_DI_23_P  (1 unrouted)
L_DI_24_P  (1 unrouted)
L_DI_25_P  (1 unrouted)
L_DI_26_P  (1 unrouted)
L_DI_27_P  (1 unrouted)
L_DI_28_P  (1 unrouted)
L_DI_29_P  (1 unrouted)
L_DI_31_P  (1 unrouted)
L_DO_0_P  (1 unrouted)
L_DO_1_P  (1 unrouted)
L_DO_2_P  (1 unrouted)
L_DO_3_P  (1 unrouted)
L_DO_4_P  (1 unrouted)
L_DO_5_P  (1 unrouted)
L_DO_6_P  (1 unrouted)
L_DO_7_P  (1 unrouted)
L_DO_8_P  (1 unrouted)
L_DO_9_P  (1 unrouted)
L_DO_10_P  (1 unrouted)
L_DO_11_P  (1 unrouted)
L_DO_12_P  (1 unrouted)
L_DO_13_P  (1 unrouted)
L_DO_14_P  (1 unrouted)
L_DO_15_P  (1 unrouted)
L_DO_16_P  (1 unrouted)
L_DO_17_P  (1 unrouted)
L_DO_18_P  (1 unrouted)
L_DO_19_P  (1 unrouted)
L_DO_20_P  (1 unrouted)
L_DO_21_P  (1 unrouted)
L_DO_22_P  (1 unrouted)
L_DO_23_P  (1 unrouted)
L_DO_24_P  (1 unrouted)
L_DO_25_P  (1 unrouted)
L_DO_26_P  (1 unrouted)
L_DO_27_P  (1 unrouted)
L_DO_28_P  (1 unrouted)
L_DO_29_P  (1 unrouted)
L_DO_30_P  (1 unrouted)
L_DO_31_P  (1 unrouted)
L_GROUND  (via drill 0.3 pad 0.6, 0.3 pad 1.2, 0.4)  (78 unrouted)
  Top 0.2: 219.91,140.56 D4.1 | 219.87,145.07 220.9,144.04 221.57,144.04 222.78,142.83 231.02,142.83 v231.04,142.85
  Top 0.254: 219.95,140.56 219.91,140.56 219.91,140.52 222.96,137.47 v226.35,137.47 | 219.87,145.07 D3.1 | D2.1 199.39,145.03 200.33,144.09 201.02,144.09 201.97,143.15 v209.43,143.15
  Top 0.406: 115.61,242.38 111.45,238.22 85.92,238.22 83.42,235.72 v80.02,235.72 | 115.62,235.45 115.61,235.45 | v113.22,237.18 115.61,239.57 | 115.63,188.47 115.61,188.49
  Top 1.27: 115.61,188.49 115.61,235.45 115.61,239.57 115.61,242.38 115.61,243.81 119.68,247.88 186.48,247.88 189.12,245.24 189.12,212.84 197.63,204.33 v218.35,204.33 | 115.63,188.47 115.63,46.33
  Bottom 0.2: 171.38,233.51 BOARD1.GND | 175.06,223.6 175.06,218.45 194.9,198.61 194.9,132.99 210.3,117.59 214.27,117.59 214.8,118.12 | 173.61,222.56 173.61,217.43 193.16,197.88 193.16,132.19 210.39,114.96 213.11,114.96 214.71,116.56 | 121.36,223.49 121.36,215.06 142.68,193.74 184.63,193.74 191.29,187.08 191.29,131.89 209.27,113.91 209.27,113.5 210.37,112.4 213.05,112.4 214.71,114.06 | 119.66,223.43 119.66,214 142.04,191.62 183.69,191.62 189.72,185.59 189.72,130.92 209.28,111.36 209.28,110.95 210.25,109.98 213.56,109.98 214.71,111.13 | TRANS_1.10 210.21,98.52 | DIGITAL_PORT.F5 227.06,96.94 TRANS_2.19 217.21,87.09 | 217.21,87.09 214.68,84.56 214.68,83.37 | 214.68,83.37 214.68,81.99 | 214.68,81.99 214.68,80.2 | 214.68,80.2 214.68,77.32 | 214.68,77.32 214.68,74.52 | 214.68,74.52 214.68,69.72 212.88,67.92 TRANS_2.10 209.58,67.92 194.2,52.54 194.2,34.81 186.41,27.02 176.55,27.02 172.81,30.76 | 172.67,33.28 177.55,28.4 185.23,28.4 191.88,35.05 191.88,52.93 209.23,70.28 209.23,70.6 210.46,71.83 211.99,71.83 214.68,74.52 | 214.68,80.2 211.26,76.78 192.19,76.78 175.37,59.96 143.68,59.96 136.36,52.64 136.36,35.46 130.3,29.4 123.12,29.4 119.66,32.86 | 214.68,77.32 211.66,74.3 193.23,74.3 176.7,57.77 145.1,57.77 138.62,51.29 138.62,35 131.41,27.79 122.28,27.79 119.43,30.64 | 214.71,109.01 213.08,107.38 210.37,107.38 209.42,108.33 209.42,108.65 187.91,130.16 187.91,145.43 187.94,145.46 187.94,147.91 173.16,162.69 | 214.71,104.7 212.25,102.24 210.39,102.24 209.45,103.18 209.45,103.5 207.58,105.37 207.55,105.37 183.37,129.55 144.05,129.55 122.87,150.73 122.87,159.7 120.27,162.3
  Bottom 0.2: 172.84,100.13 185.88,87.09 217.21,87.09 | 214.68,83.37 213.28,81.97 188.7,81.97 175.27,68.54 144.26,68.54 122.59,90.21 122.59,97.24 119.73,100.1 | 214.68,81.99 212.05,79.36 189.6,79.36 176.27,66.03 143.02,66.03 120.43,88.62 120.43,94.96 | A2-A3.4 232.32,142.27 231.74,142.85 v231.04,142.85
  Bottom 0.254: v226.35,137.47 229.05,137.47 A2-A3.4 237.86,146.29 241.84,146.29 ANALOG_PORT.21 | ANALOG_PORT.23 241.87,151.67 235.9,151.67 235.29,151.06 225.83,151.06 225.82,151.07 205.46,151.07 203.88,149.49 203.88,146.12 205.38,144.62 211.91,144.62 212.86,143.68 | A0-A1.4 212.86,143.68 | 212.86,143.68 212.33,143.15 v209.43,143.15
  Bottom 0.406: R31.2 221.35,235.79 221.36,235.78 | v113.22,237.18 113.22,235.41 115.5,233.13 BOARD2.GND 121.03,233.13 C8.2 | C8.2 C10.2 C14.2 | C8.2 122.3,227.88 C13.- C12.2 | v80.02,235.72 76.36,235.72 X1.6 | TRANS_1.19 215.52,118.84 214.8,118.12 214.71,118.03 214.71,116.56 214.71,114.06 214.71,111.13 214.71,109.01 214.71,104.7 214.71,101.31 211.92,98.52 TRANS_1.10 209.04,98.52 208.05,97.53 208.05,91.26 209.8,89.51 214.87,89.51 216.14,88.24 TRANS_2.19
  Bottom 0.508: ANALOG_PORT.37 241.92,189.61 243.34,188.2 243.34,187.02 241.92,185.61 ANALOG_PORT.35 ANALOG_PORT.34 ANALOG_PORT.33 ANALOG_PORT.32 ANALOG_PORT.31 ANALOG_PORT.30 ANALOG_PORT.29 ANALOG_PORT.28 ANALOG_PORT.27 ANALOG_PORT.26 ANALOG_PORT.25 ANALOG_PORT.24 ANALOG_PORT.23 ANALOG_PORT.22 ANALOG_PORT.21 ANALOG_PORT.20 241.92,142.17
  Bottom 1.27: SCR.1 | -POWER+.2 240.12,238.69 | 240.12,238.69 233.42,231.99 233.42,229.78 234.81,228.39 235.64,228.39 R30.2 236.56,228.33 237.12,227.77 237.12,225.71 R2.1 | 240.12,238.69 240.12,237.85 243.51,234.46 243.51,220.58 241.36,218.43 234.24,218.43 | C2.- 230,218.43 234.24,218.43 | C1.- 232.73,216.92 | 232.73,216.92 234.24,218.43 | v218.35,204.33 224.45,204.33 | 224.45,204.33 225.44,204.33 232.73,211.62 232.73,216.92 | GND.1 GND.2 GND.3 GND.4 219.86,199.74 224.45,204.33
  Bottom 2.54: C3.2 202.8,210.28 205.93,210.28 SCR.1 210.43,209.86 1K_Z.2 217.19,212.53 C4.2 | C4.2 | 232.1,235.78 -POWER+.2 | C4.2 215.36,224.89 10A10.A 221.36,235.78 232.1,235.78 | 232.09,235.79 232.1,235.78
L_SCL  (8 unrouted)
  Bottom 0.2: 145.69,203.32 BOARD1.D22
L_SDA  (8 unrouted)
N$1  (1 unrouted)
N$2
  Top 0.2: MCP2515_MOD2.1 113.25,200.65 113.25,233.03 110.6,235.68 BOARD2.3V3
N$3
  Bottom 1.27: IC2.1 221.39,225.22 R2.2 R1.1
N$4
  Bottom 0.406: R31.1 PW_LED.K
N$5
  Bottom 1.27: SCR.3 209.78,219.53 209.78,221.75 Z5.1.A 212.02,222.97 C4.1 212.11,221.59 213.68,220.02 1K_Z.1
N$6  (1 unrouted)
N$7  (1 unrouted)
N$8
  Bottom 0.406: R30.1 246.86,228.33 247.22,227.97 3V3_LED.K
N$10
  Bottom 2.54: SW_GENRL.2 226.84,246.56 225.28,248.12 219.01,248.12 216.5,245.61 FUSE.1A
N$11  (1 unrouted)
N$15  (1 unrouted)
N$16  (1 unrouted)
N$17  (1 unrouted)
N$18  (1 unrouted)
N$19  (1 unrouted)
N$20  (1 unrouted)
N$22  (1 unrouted)
N$23  (1 unrouted)
N$24  (1 unrouted)
N$27  (1 unrouted)
N$28  (1 unrouted)
N$29  (1 unrouted)
N$30
  Bottom 0.2: R6.2 97.21,220.22 97.21,236.48 95.29,238.4 91.34,238.4 86.43,233.49 LD1_M2.A
N$31  (1 unrouted)
N$32
  Top 0.2: MCP2515_MOD2.6 100.38,214.12 99.11,215.39 92.58,215.39 BOARD2.D18
N$33
  Bottom 0.2: MCP2515_MOD2.5 100.56,198.12 93.42,198.12 92.54,199 BOARD2.D23
N$34  (via drill 0.35)
  Top 0.2: v95.16,196.95 94.62,196.95 94.26,197.31 94.26,212.48 93.93,212.81 BOARD2.D19
  Bottom 0.2: MCP2515_MOD2.4 101.92,196.94 v95.17,196.94 v95.16,196.95
N$36  (1 unrouted)
N$37
  Top 0.2: MCP2515_MOD2.3 108,201.55 107.99,201.56 107.99,229.62 106.86,230.75 102.35,230.75 99.66,228.06 99.62,228.04 BOARD2.D2
N$38  (1 unrouted)
N$39  (1 unrouted)
N$40  (1 unrouted)
N$42  (1 unrouted)
N$43  (1 unrouted)
N$44  (1 unrouted)
N$45  (1 unrouted)
N$46  (1 unrouted)
N$48  (1 unrouted)
N$49  (1 unrouted)
N$51  (1 unrouted)
N$52  (1 unrouted)
N$53  (1 unrouted)
N$54  (1 unrouted)
N$56  (1 unrouted)
N$57  (1 unrouted)
N$58  (1 unrouted)
N$59  (1 unrouted)
N$60  (1 unrouted)
N$62  (1 unrouted)
N$63  (1 unrouted)
N$64  (1 unrouted)
N$65  (1 unrouted)
N$66  (1 unrouted)
N$67  (1 unrouted)
N$68  (1 unrouted)
N$69  (1 unrouted)
N$70  (1 unrouted)
N$71  (1 unrouted)
N$73  (1 unrouted)
N$74  (1 unrouted)
N$75  (1 unrouted)
N$76  (1 unrouted)
N$77  (1 unrouted)
N$78  (1 unrouted)
N$79  (1 unrouted)
N$80
  Bottom 0.2: R7.2 98.26,222.18 98.26,237.37 96.01,239.62 90.86,239.62 84.9,233.66 84.9,222.15 LD2_M2.A
N$81
  Bottom 0.2: R8.2 99.31,224.05 99.31,238.18 96.73,240.76 89.66,240.76 83.98,235.08 83.98,218.21 LD3_M2.A
N$82
  Bottom 0.2: R8.1 117.89,223.02 BOARD2.D27
N$83
  Bottom 0.2: R7.1 117.61,220.1 BOARD2.D26
N$84
  Bottom 0.2: R6.1 117.12,217.07 BOARD2.D25
N$85  (1 unrouted)
N$86  (1 unrouted)
N$87  (1 unrouted)
N$88  (1 unrouted)
N$89  (1 unrouted)
N$90  (1 unrouted)
N$91  (1 unrouted)
N$92  (1 unrouted)
N$93  (1 unrouted)
N$94  (1 unrouted)
N$95  (1 unrouted)
N$96  (1 unrouted)
N$97  (1 unrouted)
N$98  (1 unrouted)
N$99  (1 unrouted)
N$100  (1 unrouted)
N$101  (1 unrouted)
N$102  (1 unrouted)
N$103  (1 unrouted)
N$104  (1 unrouted)
N$105  (1 unrouted)
N$106  (1 unrouted)
N$107  (1 unrouted)
N$108  (1 unrouted)
N$109  (1 unrouted)
N$110  (1 unrouted)
N$111  (1 unrouted)
N$112  (1 unrouted)
N$113  (1 unrouted)
N$114  (1 unrouted)
N$115  (1 unrouted)
N$116  (1 unrouted)
N$117  (1 unrouted)
N$118  (1 unrouted)
N$119  (1 unrouted)
RX_FT232BL  (1 unrouted)
TX_FT232BL  (1 unrouted)
U0_RX_MOD1  (1 unrouted)
U0_RX_MOD2
  Bottom 0.2: BOARD2.D3 S_M2.2
U0_RX_MOD3  (1 unrouted)
U0_RX_MOD4  (1 unrouted)
U0_RX_MOD5  (1 unrouted)
U0_RX_MOD6  (1 unrouted)
U0_RX_MOD7  (1 unrouted)
U0_RX_MOD8  (1 unrouted)
U0_RX_MOD9  (1 unrouted)
U0_TX_MOD1  (1 unrouted)
U0_TX_MOD2
  Bottom 0.2: BOARD2.D1 S_M2.1
U0_TX_MOD3  (1 unrouted)
U0_TX_MOD4  (1 unrouted)
U0_TX_MOD5  (1 unrouted)
U0_TX_MOD6  (1 unrouted)
U0_TX_MOD7  (1 unrouted)
U0_TX_MOD8  (1 unrouted)
U0_TX_MOD9  (1 unrouted)
U2_RX_MOD9  (1 unrouted)
U2_TX_MOD9  (1 unrouted)
VCC_5V
  Bottom 2.54: -POWER+.1 241.23,247.69 235.51,247.69 SW_GENRL.3
VCC_5V_2  (1 unrouted)
  Bottom 0.406: PW_LED.A 197.93,235.8 197.84,235.72
  Bottom 2.54: Z5.1.C 198.4,218.59 196.74,216.93 194.83,216.93 D_SHOCK.A | 207.97,215.16 203,215.16 C3.1 198.4,219.76 Z5.1.C | FUSE.2A 195.68,237.88 197.84,235.72 200.12,233.44 10A10.C 198.4,228.06 Z5.1.C

## Text on the board
tPlace: 1 | 2
tNames: NO | ON | NO | OFF